# Altium schematic sheet Ethernet.SchDoc
size A4; Organization: Blinkinlabs, LLC
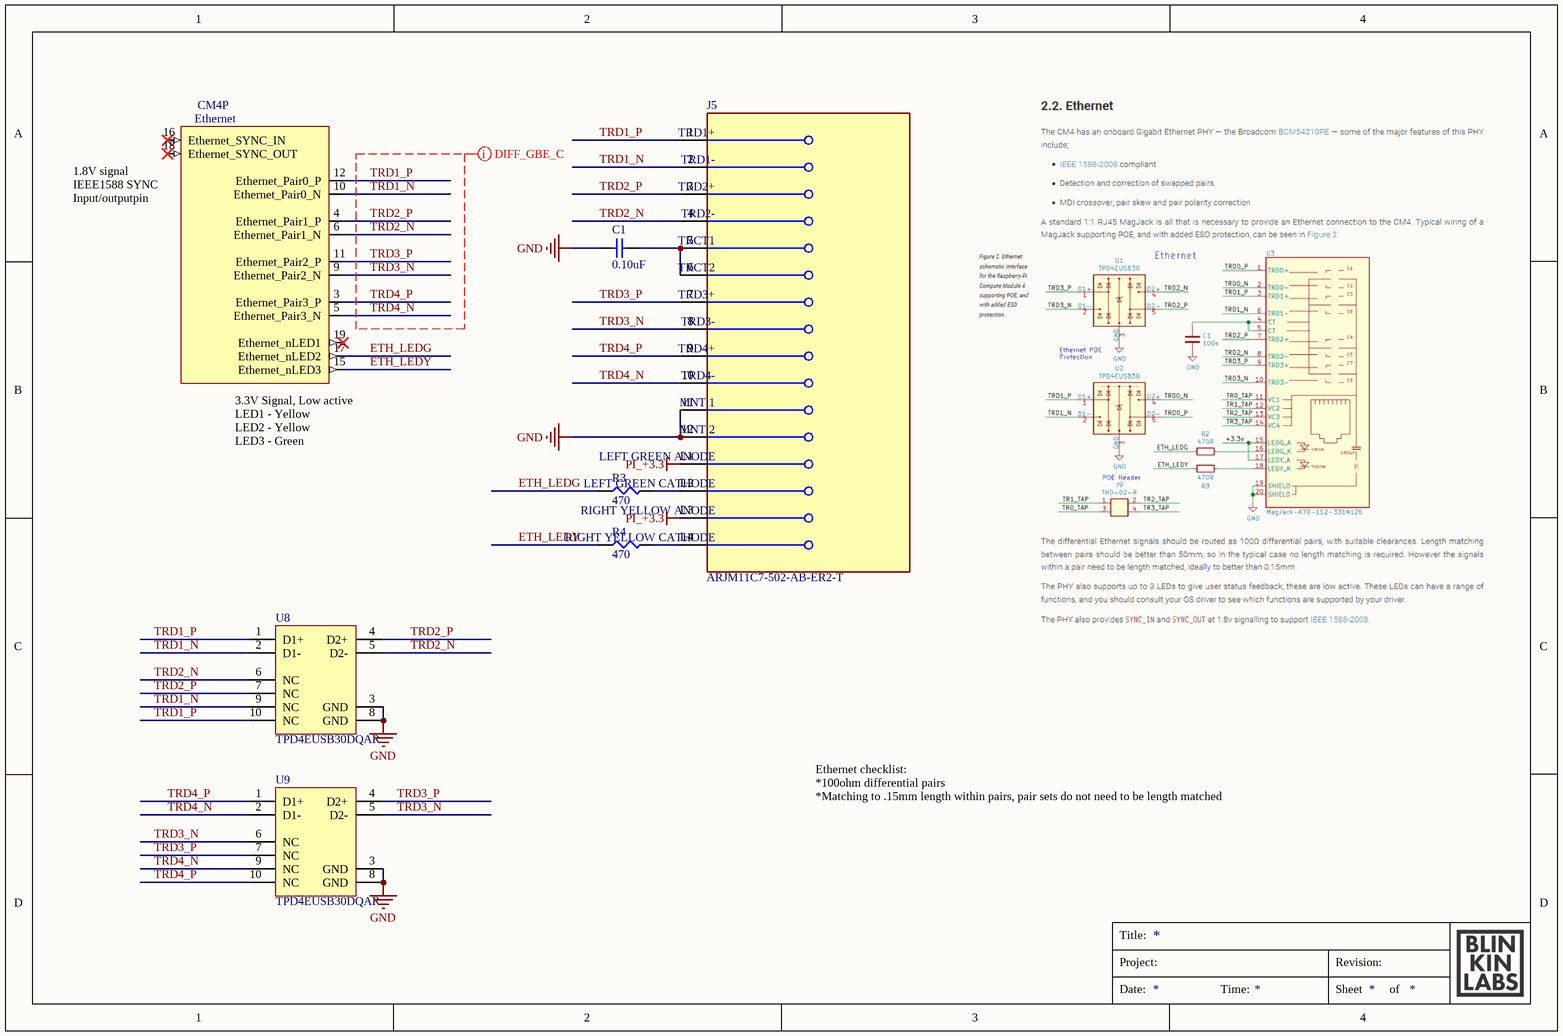
[diagram p0: Ethernet.SchDoc]

## Parts
C1  0.10uF  [CAPC1608X09L]
CM4  Raspberry Pi Compute Module 4  [CM4-F40C-100DS-0.4v_1.5mm_0mm]  (value not drawn)  (part P of 21)
J5  ARJM11C7-502-AB-ER2-T  [FP-ARJM11C7-502-AB-ER2-T-MFG]
R3  470  [ERJ2G(0402)_L]
R4  470  [ERJ2G(0402)_L]
U8  TPD4EUSB30DQAR  [DQA0010A_V]
U9  TPD4EUSB30DQAR  [DQA0010A_V]

## Nets
GND: C1.1 J5.11(MNT_1) J5.12(MNT_2) U8.3(GND) U8.8(GND) U9.3(GND) U9.8(GND)
PI_+3.3: J5.L1(LEFT_GREEN_ANODE) J5.L3(RIGHT_YELLOW_ANODE)
ETH_LEDG: CM4.17(Ethernet_nLED2) R3.1
ETH_LEDY: CM4.15(Ethernet_nLED3) R4.1
TRD1_N: CM4.10(Ethernet_Pair0_N) J5.2(TRD1-) U8.2(D1-) U8.9(NC)
TRD1_P: CM4.12(Ethernet_Pair0_P) J5.1(TRD1+) U8.1(D1+) U8.10(NC)
TRD2_N: CM4.6(Ethernet_Pair1_N) J5.4(TRD2-) U8.5(D2-) U8.6(NC)
TRD2_P: CM4.4(Ethernet_Pair1_P) J5.3(TRD2+) U8.4(D2+) U8.7(NC)
TRD3_N: CM4.9(Ethernet_Pair2_N) J5.8(TRD3-) U9.5(D2-) U9.6(NC)
TRD3_P: CM4.11(Ethernet_Pair2_P) J5.7(TRD3+) U9.4(D2+) U9.7(NC)
TRD4_N: CM4.5(Ethernet_Pair3_N) J5.10(TRD4-) U9.2(D1-) U9.9(NC)
TRD4_P: CM4.3(Ethernet_Pair3_P) J5.9(TRD4+) U9.1(D1+) U9.10(NC)
NetC1_2: C1.2 J5.5(TRCT1) J5.6(TRCT2)
NetJ5_L2: J5.L2(LEFT_GREEN_CATHODE) R3.2
NetJ5_L4: J5.L4(RIGHT_YELLOW_CATHODE) R4.2

Not connected (* = marked no-connect by the designer): CM4 16(Ethernet_SYNC_IN)* 18(Ethernet_SYNC_OUT)* 19(Ethernet_nLED1)*

## Layout directives
differential pair; differential pair class DIFF_100Ohm_GBE; differential pair class DIFF_LAN_GB; net class GBE_1Gbps; rule Matched Net Lengths [Tolerance = 0.15mm]: TRD1_N, TRD1_P, TRD2_N, TRD2_P, TRD3_N, TRD3_P, TRD4_N, TRD4_P

## Notes on the sheet
- Ethernet checklist:
  *100ohm differential pairs
  *Matching to .15mm length within pairs, pair sets do not need to be length matched
- Title:
- Project:
- Revision:
- Date:
- Time:
- Sheet
- of
- (in symbol CM4, part P) Ethernet; 1.8V signal / IEEE1588 SYNC Input/outputpin; by Amornthep Phunsin; 3.3V Signal, Low active / LED1 - Yellow / LED2 - Yellow / LED3 - Green

## Library data of the parts
C1 = GRM188R71H104KA93D: CAP CER 0.1UF 50V X7R 0603; Manufacturer: Murata Electronics North America; Tolerance: ±10%; PartNumber: GRM188R71H104KA93D; Datasheets: http://www.murata.com/~/media/webrenewal/support/library/catalog/products/capacitor/mlcc/c02e.pdf; Image: //media.digikey.com/Renders/Murata%20Renders/ZRB-SERIES-0402.jpg; Digi-Key Part Number: 490-1519-1-ND; Series: GRM; Value: 0.10uF; Voltage: 50V; Temperature Coefficient: X7R; Operating Temperature: -55°C ~ 125°C; Features: -; Applications: General Purpose; Package / Case: 0603 (1608 Metric); Case/Package: 0603
CM4 = CM4: Raspberry Pi Compute Module 4 by Amornthep Phunsin
J5 = CMP-27893-000001-1: RJ45 JACK W/MAG 1X1 1000BASE-T; Manufacturer: Abracon; Conn Gender: Female; Is Female: yes; Shielding: true; Pitch: 1.27mm; Number Of Contacts: 10; Conn Orientation: Right Angle; RoHS: TRUE; Digikey Description: RJ45 JACK W/MAG 1X1 1000BASE-T; Temperature Range Low: -40°C; ComponentLink2Description: Datasheet; Category: Conn; Temperature Range High: +85°C; Package: 0; Device Class L1: Connectors; Manufacturer Part Number: ARJM11C7-502-AB-ER2-T; ComponentLink2URL: https://abracon.com/Magnetics/ARJM11.pdf; Automotive: No; Contact Material: Gold; Height: 15.8mm; Lead Free: Yes; Temperature: -40°C to +85°C; Device Class L2: Modular / Ethernet Connectors; Device Class L3: unset; Octopart: https://octopart.com/arjm11c7-502-ab-er2-t-abracon-86945316
R3 R4 = ERJ-2GEJ471X: RES SMD 470 OHM 5% 1/10W 0402; Manufacturer: Panasonic Electronic Components; Power (Watts): 0.1W, 1/10W; Temperature Coefficient: ±200ppm/°C; PartNumber: ERJ-2GEJ471X; Datasheets: http://industrial.panasonic.com/www-cgi/jvcr13pz.cgi?E+PZ+3+AOA0001+ERJ2GEJ471X+7+WW; Image: //media.digikey.com/Photos/Panasonic%20Photos/ERJ-PA2-Series.jpg; Digi-Key Part Number: P470JCT-ND; Series: ERJ; Value: 470; Tolerance: ±5%; Composition: Thick Film; Features: Automotive AEC-Q200; Operating Temperature: -55°C ~ 155°C; Package / Case: 0402 (1005 Metric); Case/Package: 0402; Size / Dimension: 0.039" L x 0.020" W (1.00mm x 0.50mm); Height - Seated (Max): 0.016" (0.40mm); Number of Terminations: 2
U8 U9 = CMP-0326-00027-3: ESD Solution for Super-Speed (6 GBPS) USB 3.0 Interface, 4 Channels, -40 to +85 degC, 10-pin SON (DQA), Green (RoHS & no Sb/Br); Manufacturer: Texas Instruments; Differential Capacitance(pF): 0.05; Serial ATA / eSATA: TRUE; IO Capacitance(Typ)(pF): 0.8; IO Leakage Current(nA): 10; IEC 61000-4-2 Air-Gap(+/- kV): 8; ComponentLink3Description: URL Link1; PartNumber: TPD4EUSB30DQAR; DatasheetVersion: SLVSAC2C; ComponentLink2URL: http://www.ti.com/general/docs/lit/getliterature.tsp?genericPartNumber=TPD4EUSB30&fileType=pdf; USB Super Speed: TRUE; Eco-Plan: Green (RoHS & no Sb/Br); Mounting Technology: Surface Mount; 1394 / Firewire: TRUE; PackageVersion: revB, Sep-2009; SubFamily: ESD Solution; USB Full Speed: TRUE; USB High Speed: TRUE; ComponentLink2Description: Datasheet; ComponentLink1URL: http://www.ti.com/; IEC 61000-4-2 Contact(+/- kV): 8; Breakdown Voltage(Min)(V): 8; PackageReference: DQA0010A; ComponentLink1Description: Manufacturer URL; PackageDescription: 10-Pin Plastic Small Outline No-Lead, 1 x 2.5 x 0.55 mm Body, 0.5 mm Pitch; ComponentLink3URL: SamplesURL:http://www.ti.com/product/tpd4eusb30#samples; HDMI: TRUE